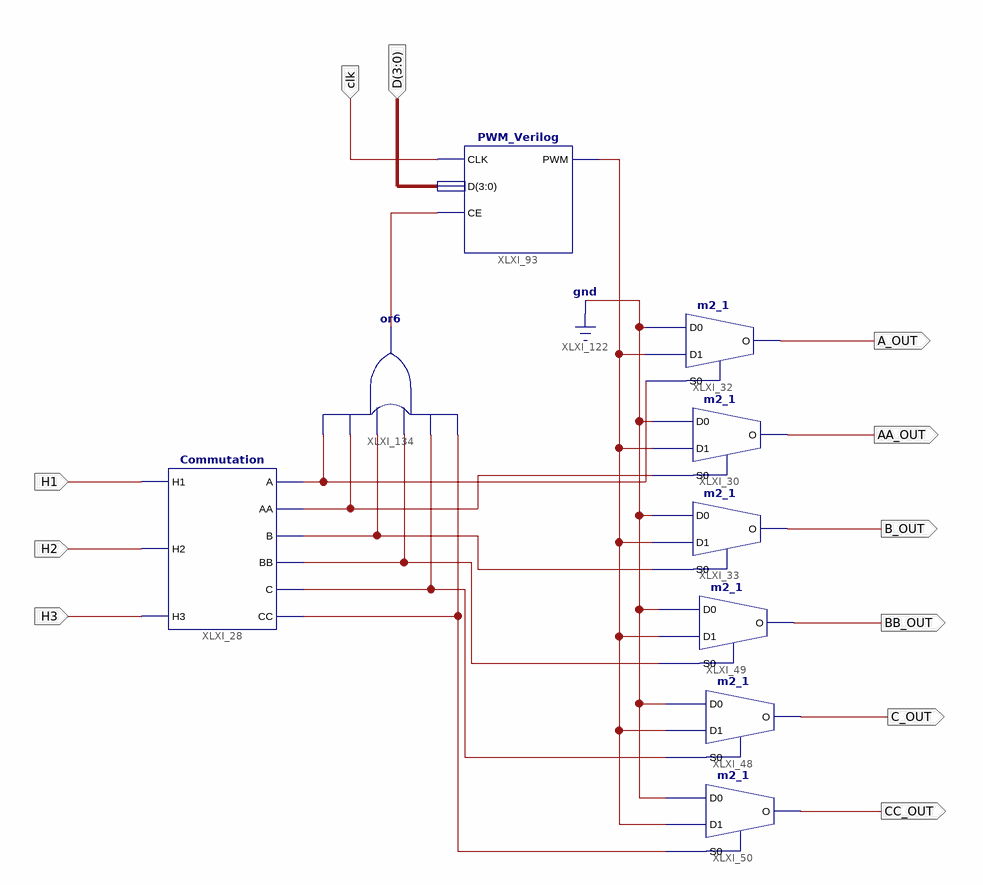
[diagram p0: schematic sheet 1]
// Xilinx ISE schematic MAIN.sch (spartan3e) as structural Verilog: 9 symbols, 11 ports
module MAIN (
  input  H3,
  input  H2,
  input  H1,
  input  [3:0] D,
  input  clk,
  output AA_OUT,
  output B_OUT,
  output BB_OUT,
  output C_OUT,
  output CC_OUT,
  output A_OUT
);

  wire XLXN_220, XLXN_222, XLXN_225, XLXN_229, XLXN_237, XLXN_238, XLXN_239, XLXN_240;

  m2_1 XLXI_30 (.D0(1'b0), .D1(XLXN_229), .S0(XLXN_222), .O(AA_OUT));
  m2_1 XLXI_32 (.D0(1'b0), .D1(XLXN_229), .S0(XLXN_220), .O(A_OUT));
  m2_1 XLXI_33 (.D0(1'b0), .D1(XLXN_229), .S0(XLXN_239), .O(B_OUT));
  m2_1 XLXI_49 (.D0(1'b0), .D1(XLXN_229), .S0(XLXN_237), .O(BB_OUT));
  m2_1 XLXI_48 (.D0(1'b0), .D1(XLXN_229), .S0(XLXN_225), .O(C_OUT));
  m2_1 XLXI_50 (.D0(1'b0), .D1(XLXN_229), .S0(XLXN_238), .O(CC_OUT));
  Commutation XLXI_28 (
    .H2(H2), .H3(H3), .H1(H1), .A(XLXN_220), .AA(XLXN_222), .B(XLXN_239), .BB(XLXN_237), .C(XLXN_225),
    .CC(XLXN_238));
  PWM_Verilog XLXI_93 (.CLK(clk), .D(D), .PWM(XLXN_229), .CE(XLXN_240));
  or XLXI_134 (XLXN_240, XLXN_238, XLXN_225, XLXN_237, XLXN_239, XLXN_222, XLXN_220);
endmodule
